# EAGLE schematic 1R (EAGLE 9.5.0)
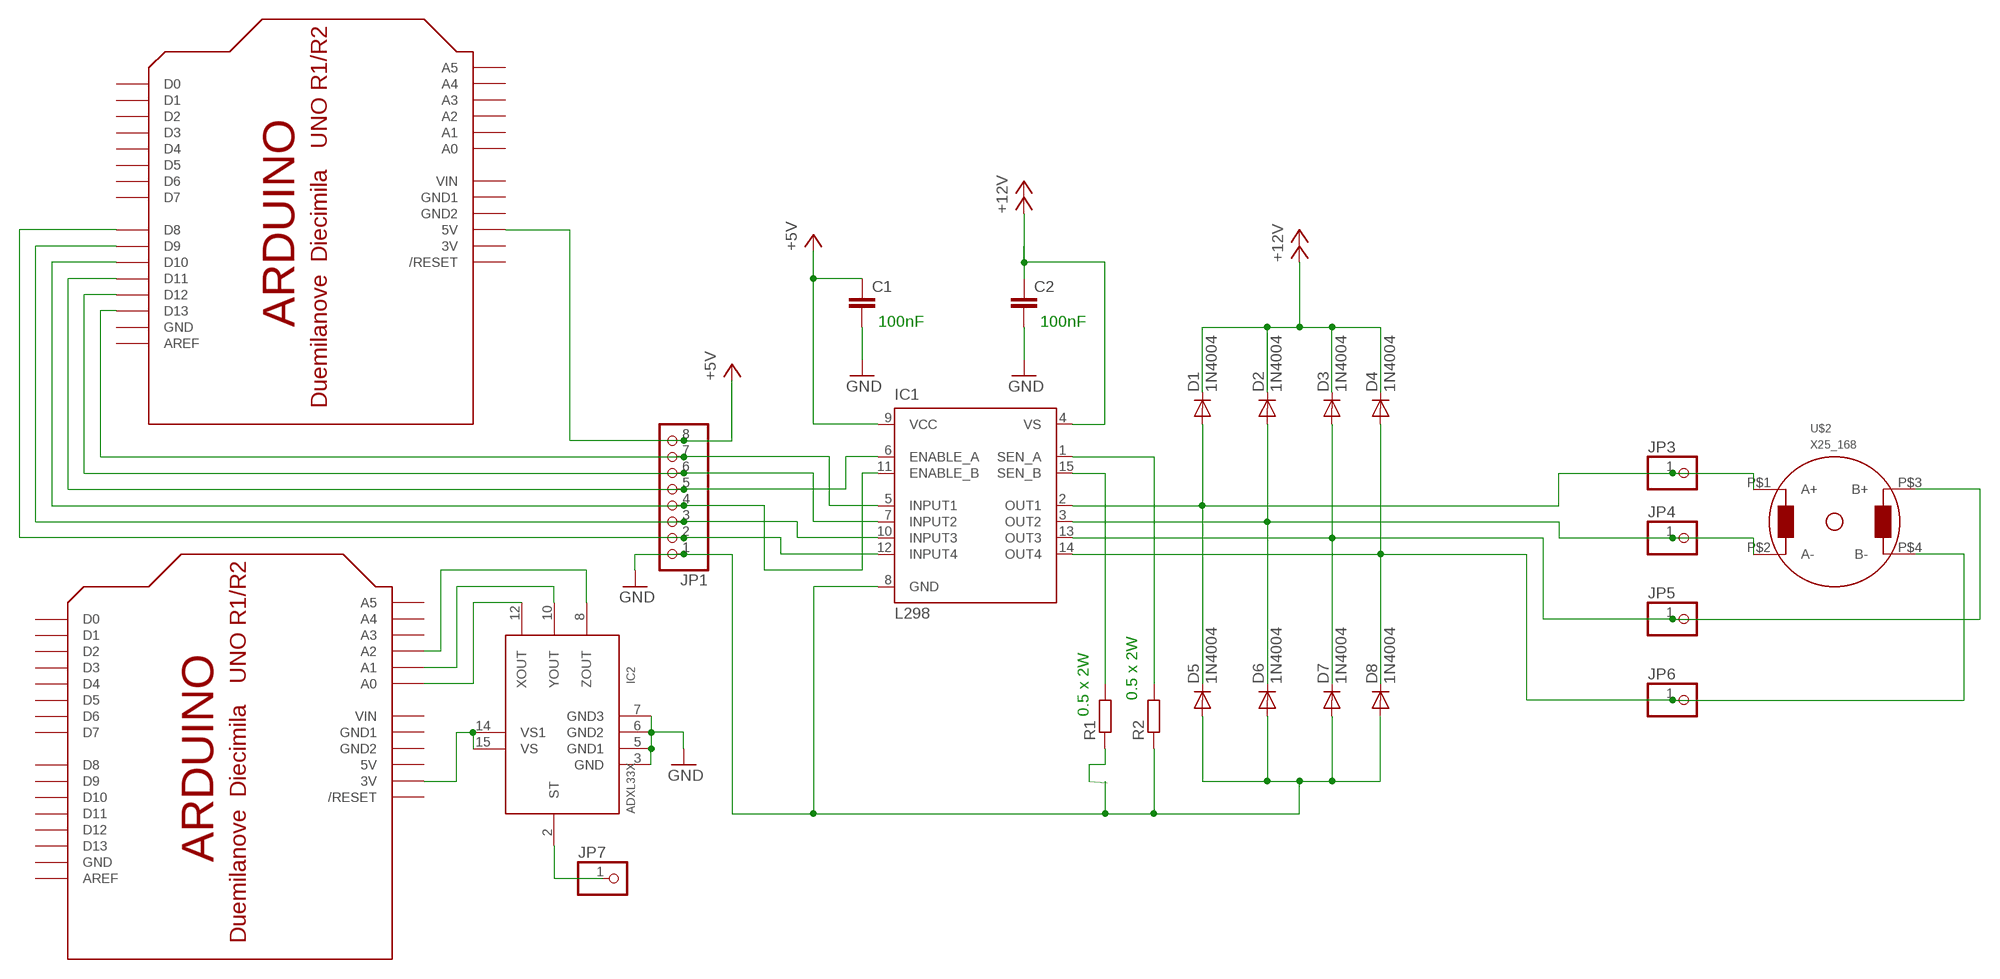
[diagram p0: schematic, sheet 1]

## Parts
C1  C2,5-3  [C2.5-3]
C2  C2,5-3  [C2.5-3]
D1  1N4004  [DO41-10]
D2  1N4004  [DO41-10]
D3  1N4004  [DO41-10]
D4  1N4004  [DO41-10]
D5  1N4004  [DO41-10]
D6  1N4004  [DO41-10]
D7  1N4004  [DO41-10]
D8  1N4004  [DO41-10]
IC1  L298  [MULTIWATT-15]
IC2  ADXL33X  [16LCSP]
JP1  PINHD-1X8-3.5MM  [1X08-3.5MM]
JP3  PINHD-1X1  [1X01]
JP4  PINHD-1X1  [1X01]
JP5  PINHD-1X1  [1X01]
JP6  PINHD-1X1  [1X01]
JP7  PINHD-1X1  [1X01]
R1  R-EU_0204/7  [0204/7]
R2  R-EU_0204/7  [0204/7]
U$1  ARDUINO-BPLACE  [ARDUINO-BPLACE]
U$2  X25_168  [X25_168]
U$3  ARDUINO-BPLACE  [ARDUINO-BPLACE]

## Nets
GND: C1.2 C2.2 D5.A D6.A D7.A D8.A IC1.8(GND) IC2.3(GND) IC2.5(GND1) IC2.6(GND2) IC2.7(GND3) JP1.1 R2.1
N$2: IC1.1(SEN_A) R2.2
N$3: IC1.5(INPUT1) JP1.7 U$1.D13
N$4: IC1.7(INPUT2) JP1.6 U$1.D12
N$5: IC1.6(ENABLE_A) JP1.5 U$1.D11
N$6: IC1.15(SEN_B) R1.2
N$7: IC1.10(INPUT3) JP1.3 U$1.D9
N$8: IC1.12(INPUT4) JP1.2 U$1.D8
N$9: IC1.11(ENABLE_B) JP1.4 U$1.D10
N$10: D4.A D8.C IC1.14(OUT4) JP6.1 U$2.P$4(B-)
N$11: D1.A D5.C IC1.2(OUT1) JP3.1 U$2.P$1(A+)
N$12: D2.A D6.C IC1.3(OUT2) JP4.1 U$2.P$2(A-)
N$13: D3.A D7.C IC1.13(OUT3) JP5.1 U$2.P$3(B+)
N$14: IC2.12(XOUT) U$3.A0
N$15: IC2.10(YOUT) U$3.A1
N$16: IC2.8(ZOUT) U$3.A2
N$17: R1.1
N$18: IC2.2(ST) JP7.1
VCC: C1.1 C2.1 D1.C D2.C D3.C D4.C IC1.4(VS) IC1.9(VCC) JP1.8 U$1.5V ; supply symbol labelled +5V, +12V
VS1: IC2.14(VS1) IC2.15(VS) U$3.3V
Unconnected: U$1.A0 U$1.A1 U$1.A2 U$1.A3 U$1.A4 U$1.A5 U$1.AREF U$1.D0 U$1.D1 U$1.D2 U$1.D3 U$1.D4 U$1.D5 U$1.D6 U$1.D7 U$1.RESET(/RESET) U$3.A3 U$3.A4 U$3.A5 U$3.AREF U$3.D0 U$3.D1 U$3.D2 U$3.D3 U$3.D4 U$3.D5 U$3.D6 U$3.D7 U$3.D8 U$3.D9 U$3.D10 U$3.D11 U$3.D12 U$3.D13 U$3.RESET(/RESET)

## Notes on the sheet
- 100nF | 100nF
- 0.5 x 2W
- 0.5 x 2W

## Power pins joined to a net without a drawn wire
3V: U$1.3V
5V: U$3.5V
GND: U$1.GND U$3.GND
GND1: U$1.GND1 U$3.GND1
GND2: U$1.GND2 U$3.GND2
VIN: U$1.VIN U$3.VIN

## Library data of the parts
C1 C2 = capacitor-wima:C: CAPACITOR naming: grid - package width
D1-D8 = adafruit:1N4004: DIODE General purpose 1N400x type rectifier (With bigger pads) http://www.ladyada.net/library/pcb/eaglelibrary.html
IC1 = st-microelectronics:L298: DUAL FULL-BRIDGE DRIVER; MPN: L298N; OC_FARNELL: 1589425; OC_NEWARK: 32M1527
IC2 = adafruit:ADXL33X
JP1 = adafruit:PINHD-1X8: PIN HEADER
JP3-JP7 = adafruit:PINHD-1X1: Pin header 1x1 for 0.1" spacing With round pins
R1 R2 = rcl:R-EU_: RESISTOR, European symbol; SPICEPREFIX: R
U$1 U$3 = adafruit:ARDUINO: Arduino Diecimila/Duemilanove Make a shield with ease, this package has all the named pins as well as the two mounting drill holes and an outline of the USB and DC power connector. The outline is on the DIMENSION layer, so if your board house uses it they will cut the outline to match. http://www.ladyada.net/library/pcb/eaglelibrary.html
U$2 = x25_168:X25_168: X25168 - Miniature stepper motor for analog gauge